# EasyEDA Pro project TOF_Sensor_Unit_6180.eprj

# Schematic Schematic1
Board Name: Board1; Create Date: 2025-10-29; Page Name: P1; Project Name: TOF_Sensor_Unit_6180; Schematic Name: Schematic1; Update Date: 2025-10-29; Company: EasyEDA.com; Drawn: EasyEDA; Page Size: A4; Part Number: JLCPCB-002; Reviewed: EasyEDA; Version: V0.1
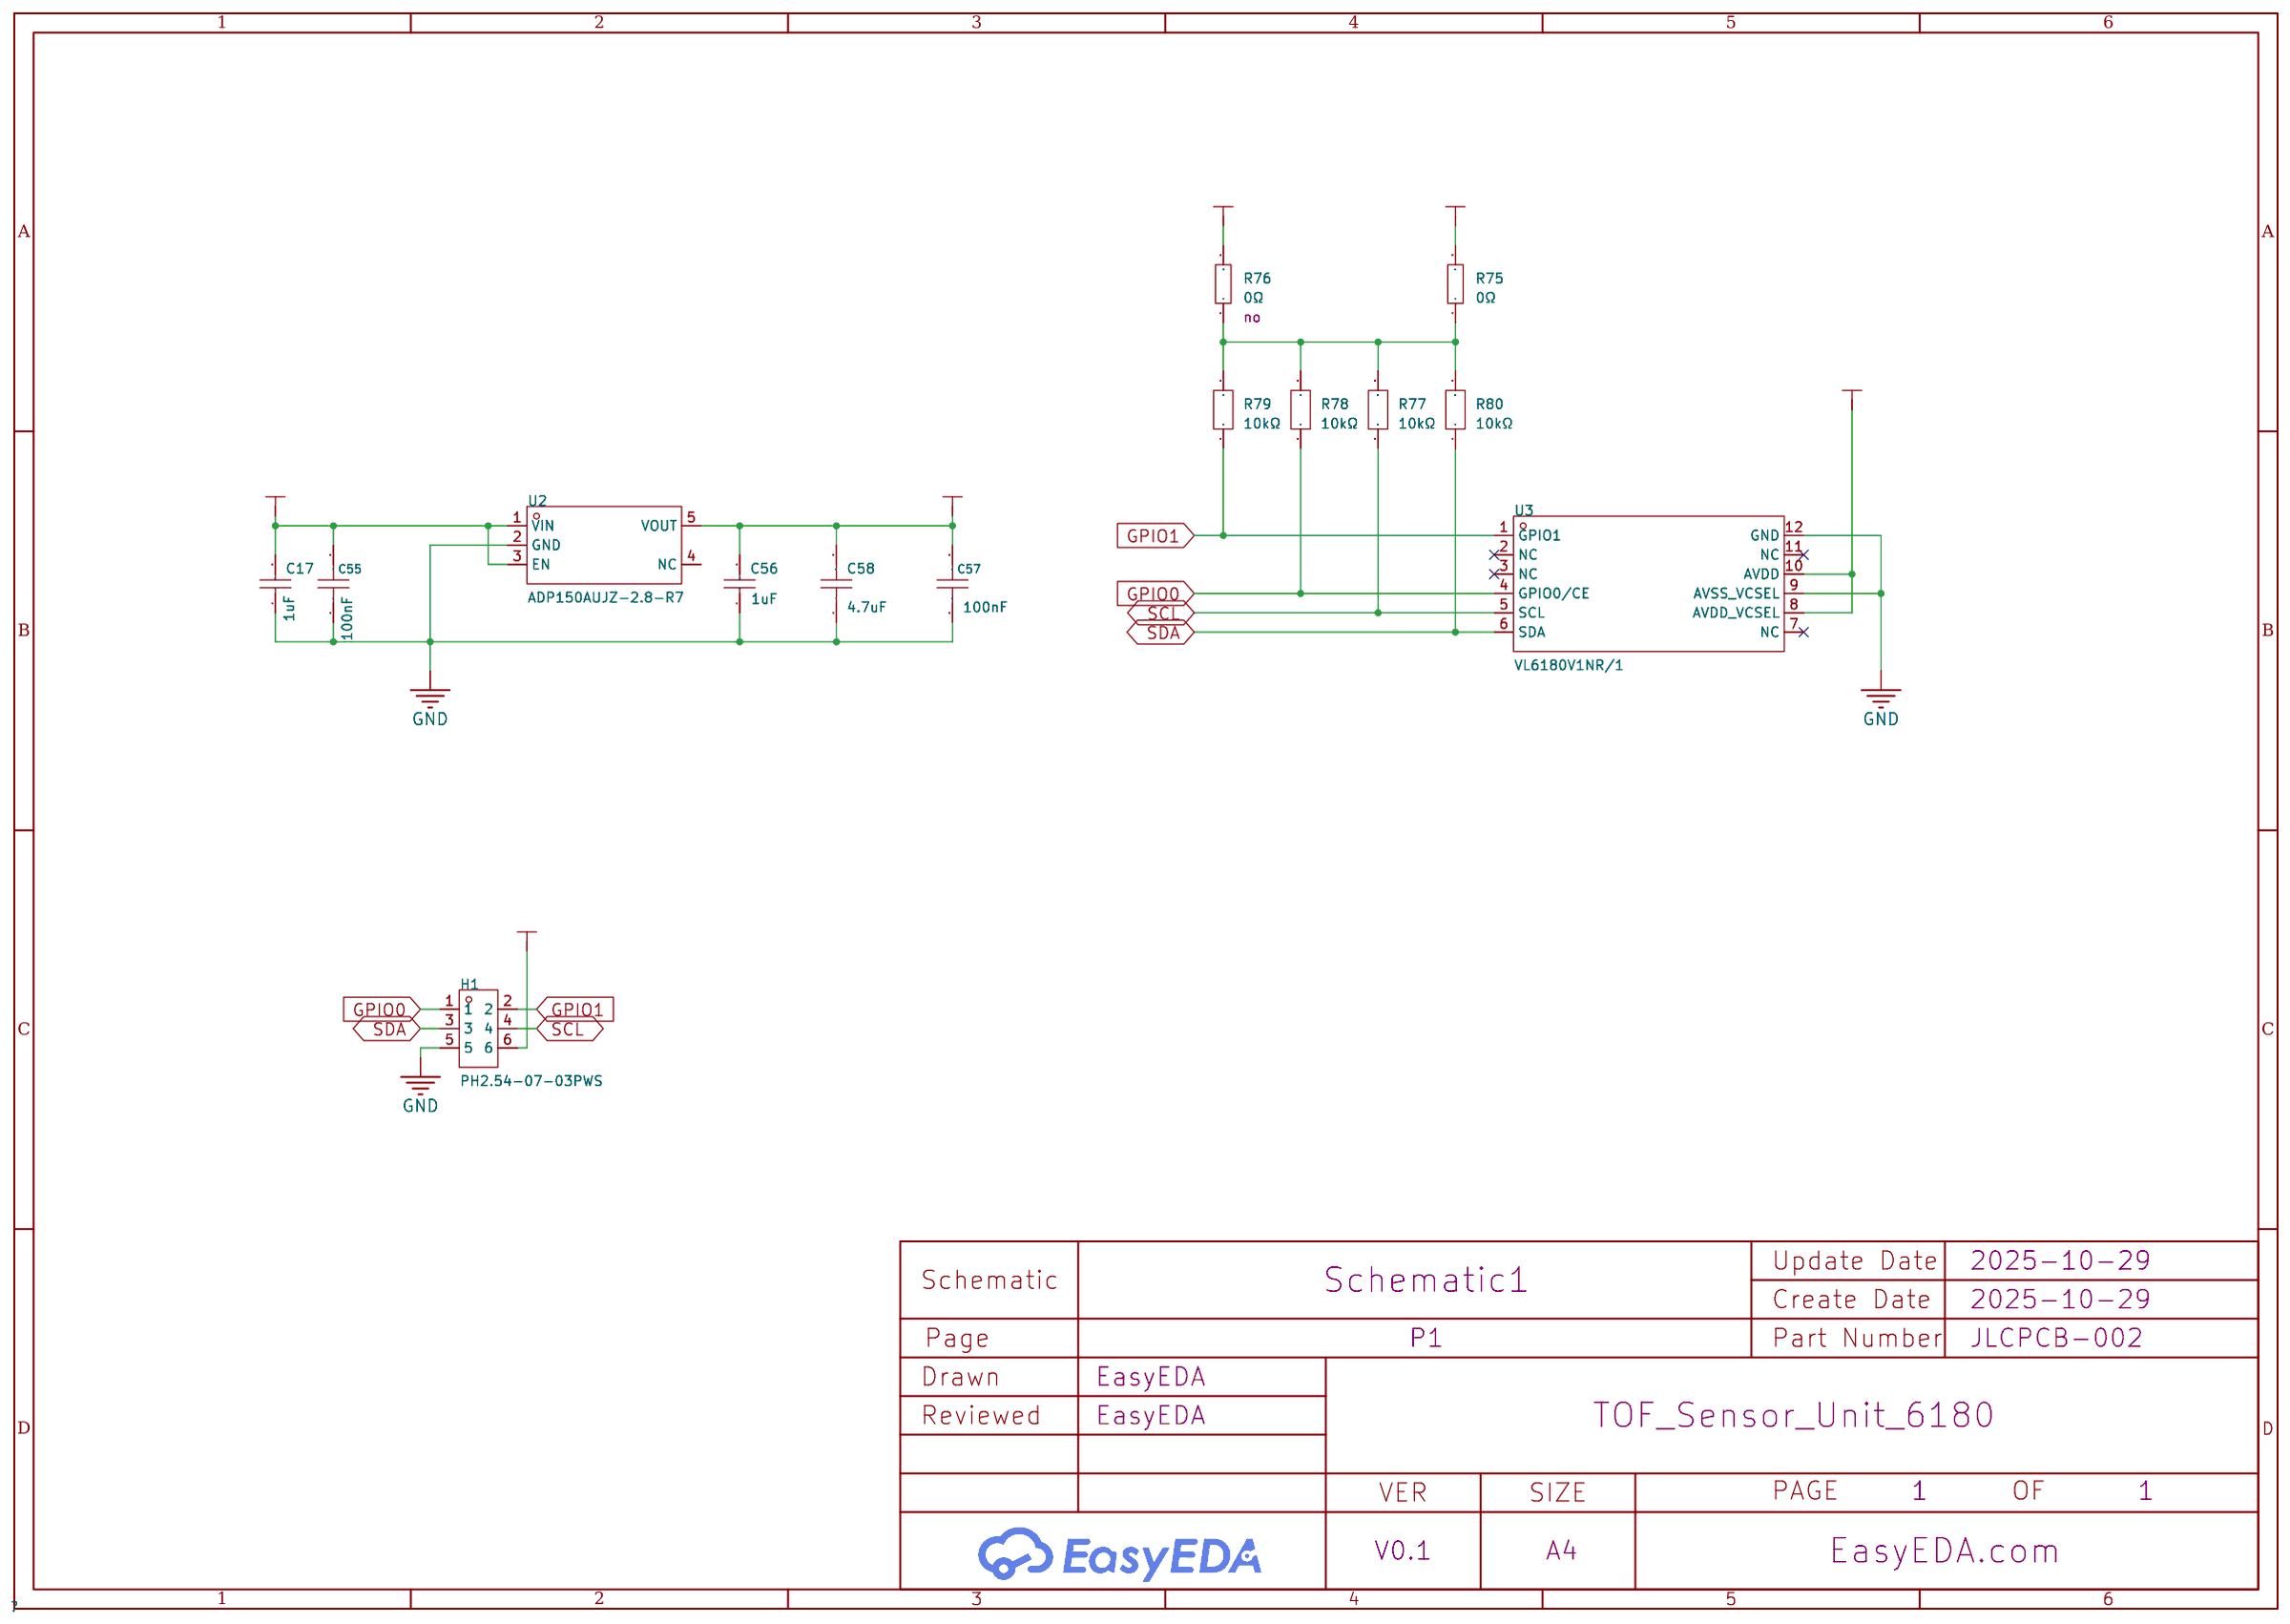
[diagram p0: schematic sheet]

## Parts
C17  1uF  [C0603]
C55  100nF  [C0603]
C56  1uF  [C0603]
C57  100nF  [C0603]
C58  4.7uF  [C0603]
H1  PH2.54-07-03PWS  [HDR-TH_6P-P2.54-H-M-R2-C3-S2.54-W12.3-N]
R75  0Ω  [R0603]
R76  0Ω  [R0603]  (no BOM)
R77  10kΩ  [R0603]
R78  10kΩ  [R0603]
R79  10kΩ  [R0603]
R80  10kΩ  [R0603]
U2  ADP150AUJZ-2.8-R7  [TSOT-23-5_L2.9-W1.6-P0.95-LS2.8-BL]
U3  VL6180V1NR/1  [LGA-12_L4.8-W2.8-P0.75-BL]

## Library data of the parts
C17 C56 = CL10A105KO8NNNC: Capacitance: Tolerance:±10% Tolerance:±10% Voltage Rated: Temperature Coefficient:; LCSC Part Name: 1uF ±10% 16V; Supplier Part: C1592; Manufacturer: SAMSUNG(三星); Supplier Footprint: 0603; JLCPCB Part Class: Extended Part; Datasheet: https://atta.szlcsc.com/upload/public/pdf/source/20220919/9FBE606BE0D9532D730F292EB26DC5BB.pdf; Supplier: LCSC; Tolerance: ±10%
C55 C57 = CC0603KRX7R6BB104: Capacitance: Tolerance:±10% Tolerance:±10% Voltage Rated: Temperature Coefficient:; LCSC Part Name: 100nF ±10% 10V; Supplier Part: C519438; Manufacturer: YAGEO(国巨); Supplier Footprint: 0603; JLCPCB Part Class: Extended Part; Datasheet: https://atta.szlcsc.com/upload/public/pdf/source/20200423/C519438_5D8E3909BA347820A92655F61B0D4FC7.pdf; Supplier: LCSC; Tolerance: ±10%
C58 = CGA0603X5R475K250JT: Capacitance:4.7uF Tolerance:±10% Tolerance:±10% Voltage Rating:25V Temperature Coefficient:X5R; LCSC Part Name: 4.7uF ±10% 25V; Supplier Part: C6119856; Manufacturer: HRE(芯声); Supplier Footprint: 0603; JLCPCB Part Class: Extended Part; Supplier: LCSC; Tolerance: ±10%; Voltage Rating: 25V; Temperature Coefficient: X5R
H1 = PH2.54-07-03PWS: Pin Structure:2x3P Pitch:2.54mm Circluar Pins/Square Pins:Pin Header Mounting Type:Right Angle Number of Rows:2 Number of Pins:6P Length of Mating Pin:6mm Insulation Height:2.5mm Contact Material:Brass Operating Temperature:-40℃~+105℃ Operating Temperatur; LCSC Part Name: 2x3P 间距:2.54mm 方针 弯插; Supplier Part: C7501617; Manufacturer: XUNPU(讯普); Supplier Footprint: 弯插,P=2.54mm; JLCPCB Part Class: Extended Part; Datasheet: https://item.szlcsc.com/datasheet/PH2.54-07-03PWS/8584171.html; Supplier: LCSC; Pin Structure: 2x3P; Pitch: 2.54mm; Circluar Pins/Square Pins: Pin Header; Mounting Type: Right Angle; Number of Rows: 2; Number of Pins: 6P; Length of Mating Pin: 6mm; Insulation Height: 2.5mm; Contact Material: Brass; Operating Temperature: -40℃~+105℃; Color: Black
R75 R76 = 0603WAF0000T5E: Type:Thick Film Resistor Resistance:0Ω Tolerance:±1% Tolerance:±1% Power(Watts):100mW Voltage-Supply(Max):75V Temperature Coefficient:- Temperature Coefficient:- Operating Temperature:-55℃~+155℃ Operating Temperature:-55℃~+155℃; LCSC Part Name: 0Ω ±1% 100mW 厚膜电阻; Supplier Part: C21189; Manufacturer: UNI-ROYAL(厚声); Supplier Footprint: 0603; JLCPCB Part Class: Basic Part; Datasheet: https://item.szlcsc.com/datasheet/0603WAF0000T5E/21903.html; Supplier: LCSC; Type: Thick Film Resistor; Tolerance: ±1%; Power(Watts): 100mW; Voltage-Supply(Max): 75V; Operating Temperature: -55℃~+155℃
R77-R80 = FRC0603J103 TS: Type:Thick Film Resistor Resistance:10kΩ Tolerance:±5% Tolerance:±5% Power(Watts):100mW Voltage-Supply(Max):75V Temperature Coefficient:±100ppm/℃ Temperature Coefficient:±100ppm/℃ Operating Temperature:-55℃~+155℃ Operating Temperature:-55℃~+155℃; LCSC Part Name: 10kΩ ±5% 100mW 厚膜电阻; Supplier Part: C2930027; Manufacturer: FOJAN(富捷); Supplier Footprint: 0603; JLCPCB Part Class: Extended Part; Datasheet: https://item.szlcsc.com/datasheet/FRC0603J103%2520TS/3266960.html; Supplier: LCSC; Type: Thick Film Resistor; Tolerance: ±5%; Power(Watts): 100mW; Voltage-Supply(Max): 75V; Temperature Coefficient: ±100ppm/℃; Operating Temperature: -55℃~+155℃
U2 = ADP150AUJZ-2.8-R7: Output Type:Fixed Voltage - Supply:5.5V Output Voltage:2.8V Output Voltage:2.8V Output Current:150mA Power Supply Rejection Ratio (PSRR):70dB@(10kHz) Voltage Dropout:105mV@(150mA) standby current:220uA Noise:9uVrms Features:Over Current Protection；Enable；; LCSC Part Name: 超低噪声、150 mA CMOS线性调节器; Supplier Part: C208565; Manufacturer: ADI(亚德诺); Supplier Footprint: TSOT-23-5; JLCPCB Part Class: Extended Part; Datasheet: https://item.szlcsc.com/datasheet/ADP150AUJZ-2.8-R7/209597.html; Supplier: LCSC; Output Type: Fixed; Voltage - Supply: 5.5V; Output Voltage: 2.8V; Output Current: 150mA; Power Supply Rejection Ratio (PSRR): 70dB@(10kHz); Voltage Dropout: 105mV@(150mA); standby current: 220uA; Noise: 9uVrms; Features: Over Current Protection；Enable；Over Temperature Protection; Operating Temperature: -40℃~+125℃@(Tj); Output Configuration: Positive; Number of Outputs: 1
U3 = VL6180V1NR/1: Voltage - Supply:2.6V~3V Voltage - Supply:2.6V~3V Linear Range:0cm~62cm Linear Range:0cm~62cm; LCSC Part Name: I2C接口的接近传感器模块; Supplier Part: C2655167; Manufacturer: ST(意法半导体); Supplier Footprint: SMD-12P; JLCPCB Part Class: Extended Part; Datasheet: https://atta.szlcsc.com/upload/public/pdf/source/20210601/445B6E214A1851E4E63FE7A9FF5CA4D1.pdf; Supplier: LCSC; Voltage - Supply: 2.6V~3V; Linear Range: 0cm~62cm

## Nets
2V8: C56.2 C57.2 C58.2 R75.2 U2.5(VOUT) U3.8(AVDD_VCSEL) U3.10(AVDD)
3V3: C17.2 C55.2 H1.6 R76.2 U2.1(VIN) U2.3(EN)
GND: C17.1 C55.1 C56.1 C57.1 C58.1 H1.5 U2.2(GND) U3.9(AVSS_VCSEL) U3.12(GND)
GPIO0: H1.1 R78.1 U3.4(GPIO0/CE)
GPIO1: H1.2 R79.1 U3.1(GPIO1)
SCL: H1.4 R77.1 U3.5(SCL)
SDA: H1.3 R80.1 U3.6(SDA)
$1N4501: R75.1 R76.1 R77.2 R78.2 R79.2 R80.2

Not connected (* = marked no-connect by the designer): U2 4(NC); U3 2(NC)* 3(NC)* 7(NC)* 11(NC)*

# Board PCB1
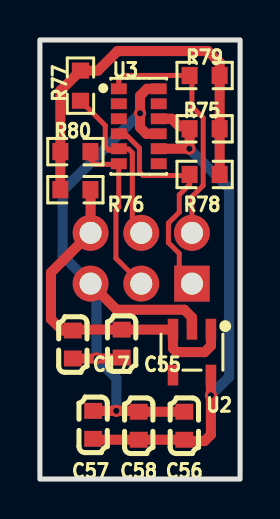
[diagram p1: board, top side]
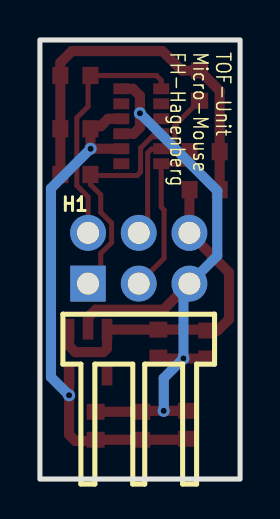
[diagram p2: board, bottom side, seen from below]

Outline 10.03 x 21.97 mm; copper layers: Top Layer, Bottom Layer. Coordinates in mm from the lower left corner of the outline.
Outline path: rectangle 0,21.97 10.03,0
Stack: Top Layer 0.035mm / Dielectric1 1.51mm FR4 er 4.5 / Bottom Layer 0.035mm

## Design rules (mm)
template: JLCPCB Capability(Two Layers Board)
spacing copperThickness1oz (default): track to track 0.102, other pairs 0.152 to 0.3
spacing copperThickness2oz: track to track 0.203, other pairs 0.152 to 0.3
track width copperThickness1oz (default): min 0.127, default 0.254, max 2.54
track width copperThickness2oz: min 0.203, default 0.254, max 2.54
differential pair differentialPair (default): width min 0.127, default 0.254, max 2.54; gap min 0.152, default 0.152
via viaSize (default): diameter min 0.5, default 0.61, max 10; hole min 0.3, default 0.305, max 6.3

## Placement (name value [footprint] x y rotation side)
C17  1uF  [C0603]  1.65 6.73 90 top
C55  100nF  [C0603]  4.1 6.78 90 top
C56  1uF  [C0603]  7.24 2.67 270 top
C57  100nF  [C0603]  2.67 2.71 270 top
C58  4.7uF  [C0603]  4.95 2.67 270 top
H1  PH2.54-07-03PWS  [HDR-TH_6P-P2.54-H-M-R2-C3-S2.54-W12.3-N]  5.08 11.05 180 bottom
R75  0Ω  [R0603]  8.25 17.53 180 top
R76  0Ω  [R0603]  1.78 14.48 0 top
R77  10kΩ  [R0603]  2.03 19.69 90 top
R78  10kΩ  [R0603]  8.25 15.24 0 top
R79  10kΩ  [R0603]  8.25 20.19 0 top
R80  10kΩ  [R0603]  1.78 16.38 180 top
U2  ADP150AUJZ-2.8-R7  [TSOT-23-5_L2.9-W1.6-P0.95-LS2.8-BL]  7.62 6.35 180 top
U3  VL6180V1NR/1  [LGA-12_L4.8-W2.8-P0.75-BL]  4.95 17.65 270 top

## Footprints (pads in the part's own frame, mm; a bottom-side part is the same pattern mirrored in y, then rotated)
C0603
  rect 0.8x0.9 smd: 1(-0.7,0) 2(0.7,0)
HDR-TH_6P-P2.54-H-M-R2-C3-S2.54-W12.3-N
  rect 1.778x1.8 hole 1.1: 1(-2.54,-1.27)
  round 1.8 hole 1.1: 2(-2.54,1.27) 3(0,-1.27) 4(0,1.27) 5(2.54,-1.27) 6(2.54,1.27)
LGA-12_L4.8-W2.8-P0.75-BL
  rect 0.55x0.8 smd: 1(-1.875,-1) 2(-1.125,-1) 3(-0.375,-1) 4(0.375,-1) 5(1.125,-1) 6(1.875,-1) 7(1.875,1) 8(1.125,1) 9(0.375,1) 10(-0.375,1) 11(-1.125,1) 12(-1.875,1)
R0603
  rect 0.806x0.864 smd: 1(-0.753,0) 2(0.753,0)
TSOT-23-5_L2.9-W1.6-P0.95-LS2.8-BL
  rect 0.532x1.045 smd: 1(-0.95,-1.147) 2(0,-1.147) 3(0.95,-1.147) 4(0.95,1.147) 5(-0.95,1.147)

## Nets
As in the schematic.

Pads without a net: U2 4; U3 2 3 7 11

## Via types
v1: diameter 0.61, hole 0.305, Top Layer to Bottom Layer, 5 vias

## Routing (per net, layer and track width the routed paths; a pad name or vN(x,y) marks a point on that pad's centre or on a via; arc(x,y) is an arc through that point)
2V8: length 26.9
  Top Layer w0.508: C57.2 2.71,1.97 C58.2 C56.2 7.3,1.91 8.25,1.91 8.57,2.22 v1(8.57,4.19) U2.5 ; U3.10 6.61,18.03 6.99,17.65 7.37,17.65 R75.2 7.5,16.54 v1(7.49,16.53) U3.8
  Bottom Layer w0.508: v1(7.49,16.53) 9.48,14.54 9.48,5.1 v1(8.57,4.19)
3V3: length 17.6
  Top Layer w0.508: R76.2 2.54,14.47 H1.6 0.55,10.33 0.55,8 1.12,7.43 C17.2 1.7,7.48 C55.2 6.65,7.48 U2.3 6.67,6.54 6.86,6.35 8.25,6.35 8.57,6.67 U2.1
GND: length 34.8
  Top Layer w0.508: C55.1 4.05,6.03 v1(2.84,6.03) 1.65,6.03 ; U2.2 7.62,8.09 7.24,8.47 3.85,8.47 H1.5 ; C56.1 C58.1 4.91,3.41 v1(3.83,3.41) C57.1 ; U3.12 5.37,19.53 5.02,19.18 v1(5.02,18.3) 5.02,17.59 5.33,17.28 U3.9
  Bottom Layer w0.508: v1(3.83,3.41) 3.83,5.04 v1(2.84,6.03) 2.84,9.48 H1.5 1.14,11.18 1.14,14.43 v1(5.02,18.3)
GPIO0: length 11.5
  Top Layer w0.254: U3.4 4.27,17.28 4.99,16.56 4.99,15.37 5.17,15.19 7.45,15.19 R78.1 7.5,14.74 6.99,14.22 6.99,13.35 6.44,12.81 6.44,11.83 6.99,11.29 6.99,10.41 H1.1
GPIO1: length 12.5
  Top Layer w0.254: H1.2 7.62,14.13 8.18,14.69 8.18,18.07 7.62,18.64 7.62,20.07 R79.1 4.19,20.19 3.95,19.95 U3.1
SCL: length 8.5
  Top Layer w0.254: H1.4 4.63,12.77 4.63,16.32 4.44,16.51 3.97,16.51 U3.5 3.88,16.46 3.45,16.46 3.27,16.64 3.27,17.69 R77.1
SDA: length 8.5
  Top Layer w0.254: R80.1 2.53,16.01 2.79,15.75 3.92,15.75 U3.6 3.95,13.61 3.81,13.46 3.81,11.05 H1.3
$1N4501: length 19.6
  Top Layer w0.508: R78.2 R75.1 R79.2 9.01,20.84 8.43,21.42 3.89,21.42 2.91,20.44 R77.2 1.02,19.43 R80.2 R76.1

## Text on the board
Bottom Silkscreen Layer: TOF-Unit / Micro-Mouse / FH-Hagenberg
